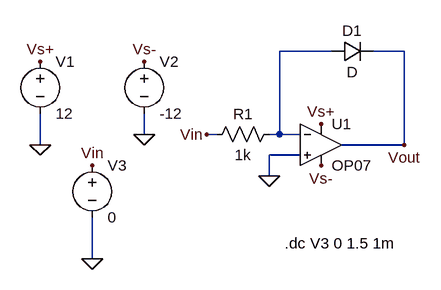
[diagram p0: schematic Task 5.asc]
Task 5.asc, the LTspice schematic file:
Version 4
SHEET 1 880 680
WIRE 352 32 272 32
WIRE 464 32 416 32
WIRE 64 160 64 128
WIRE 176 160 160 160
WIRE 272 160 272 32
WIRE 272 160 256 160
WIRE 304 160 272 160
WIRE -96 176 -96 128
WIRE 464 176 464 32
WIRE 464 176 368 176
WIRE 304 192 256 192
WIRE 256 224 256 192
WIRE -16 352 -16 288
FLAG -96 176 0
FLAG 64 160 0
FLAG -16 352 0
FLAG 256 224 0
FLAG -96 48 Vs+
FLAG 336 144 Vs+
FLAG 64 48 Vs-
FLAG 336 208 Vs-
FLAG -16 208 Vin
FLAG 160 160 Vin
FLAG 464 176 Vout
SYMBOL voltage -96 32 R0
WINDOW 123 0 0 Left 0
WINDOW 39 0 0 Left 0
SYMATTR InstName V1
SYMATTR Value 12
SYMBOL voltage 64 32 R0
WINDOW 123 0 0 Left 0
WINDOW 39 0 0 Left 0
SYMATTR InstName V2
SYMATTR Value -12
SYMBOL voltage -16 192 R0
WINDOW 123 0 0 Left 0
WINDOW 39 0 0 Left 0
SYMATTR InstName V3
SYMATTR Value 0
SYMBOL OpAmps\\OP07 336 112 R0
SYMATTR InstName U1
SYMBOL diode 352 48 R270
WINDOW 0 32 32 VTop 2
WINDOW 3 0 32 VBottom 2
SYMATTR InstName D1
SYMBOL res 272 144 R90
WINDOW 0 0 56 VBottom 2
WINDOW 3 32 56 VTop 2
SYMATTR InstName R1
SYMATTR Value 1k
TEXT 280 328 Left 2 !.dc V3 0 1.5 1m

The netlist it stands for:
* Task 5.asc
V1 Vs+ 0 12
V2 Vs- 0 -12
V3 Vin 0 0
XU1 0 N001 Vs+ Vs- Vout LT1001  ; OP07, pins In+ In- V+ V- OUT
D1 N001 Vout D
R1 N001 Vin 1k
.model D D
.lib standard.dio
.dc V3 0 1.5 1m
.lib LTC.lib
.backanno
.end